# Altium schematic sheet RXTX4F.SchDoc
size B
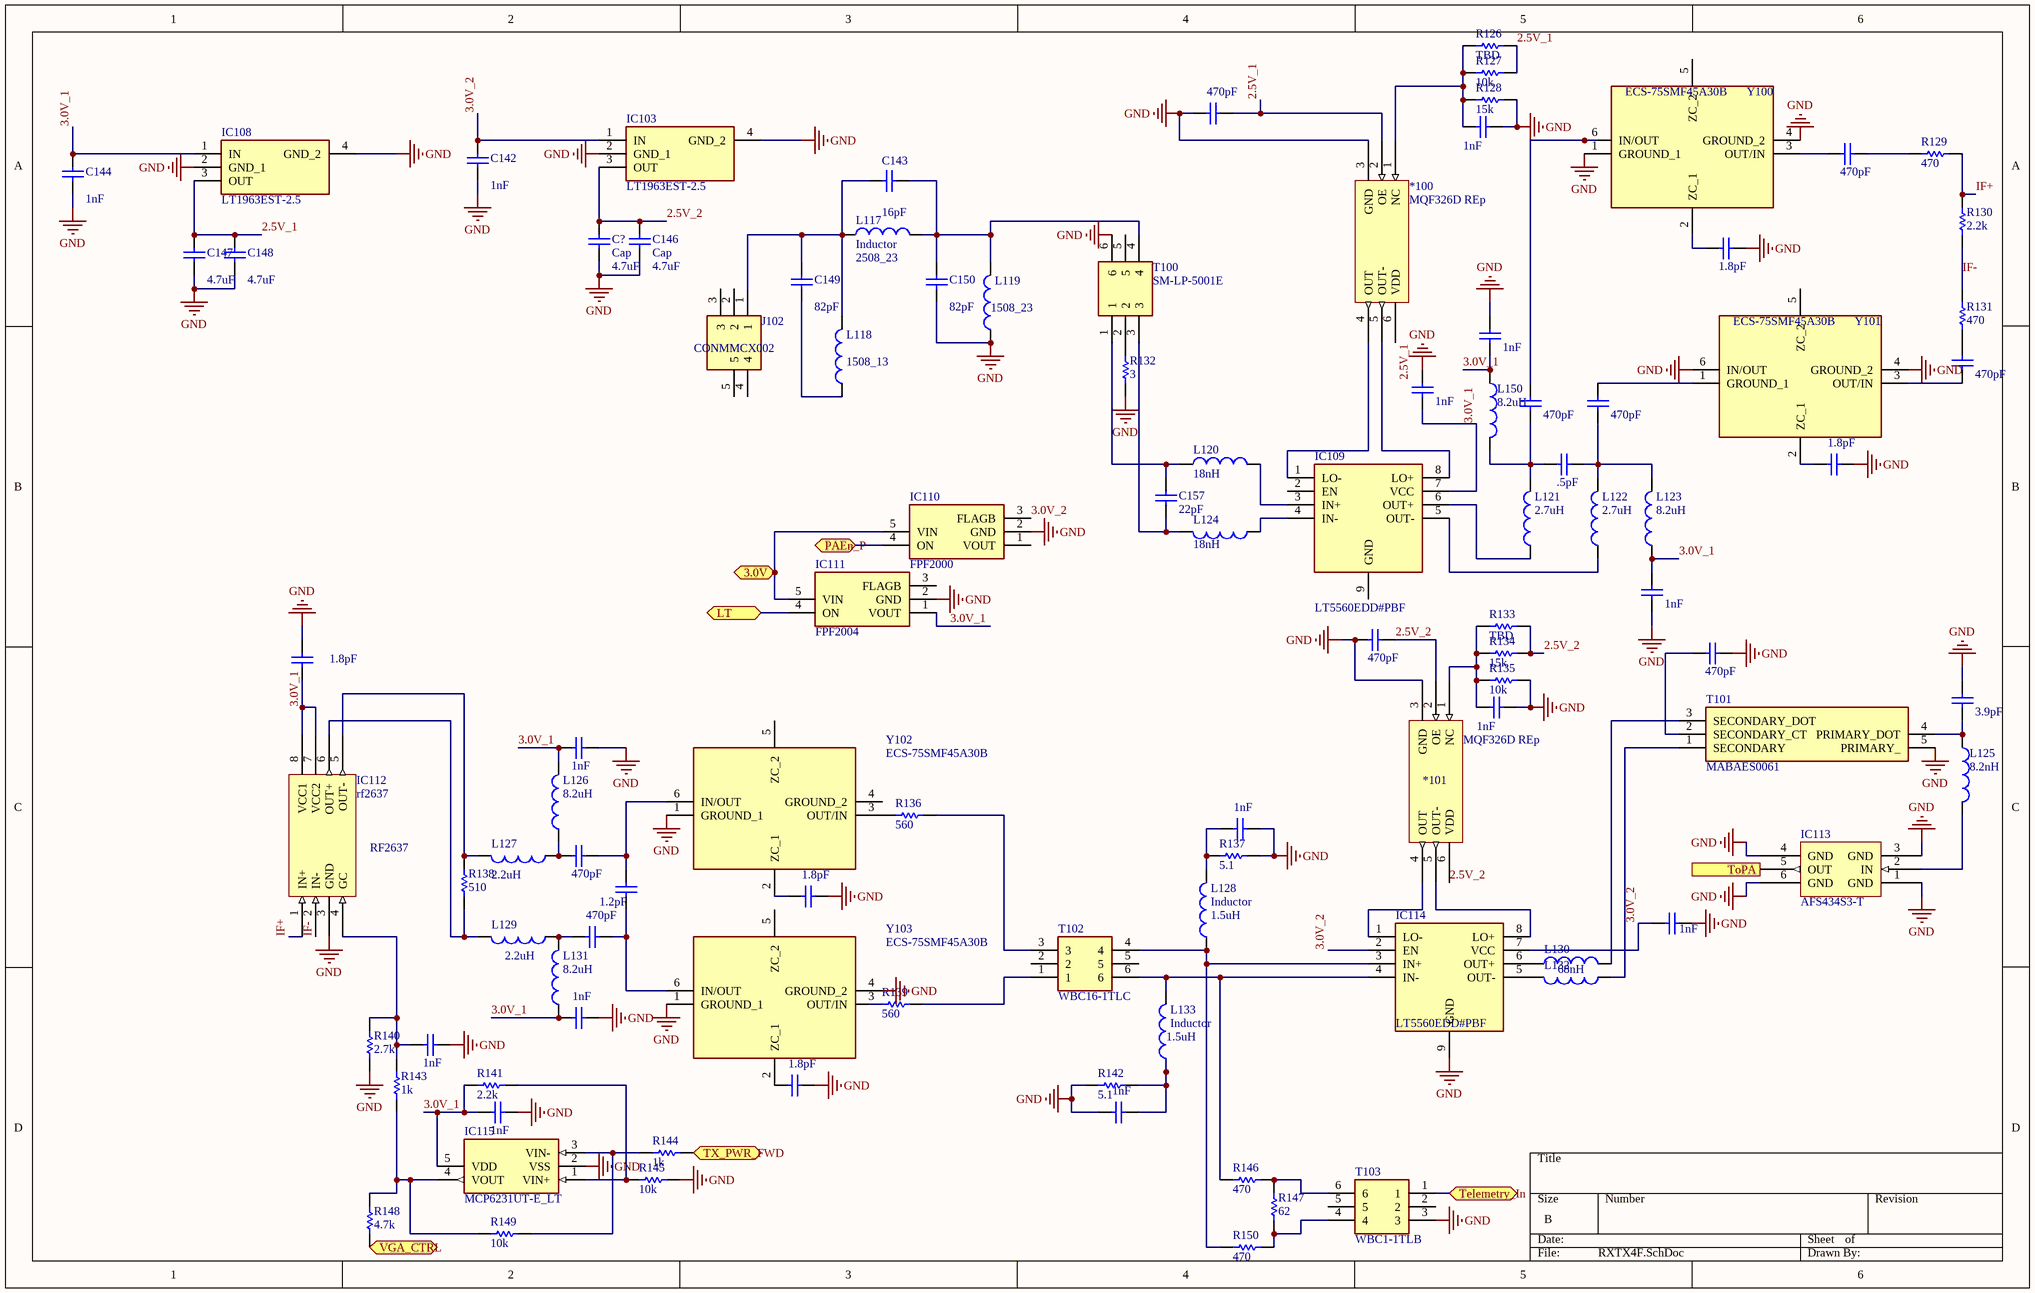
[diagram p0: RXTX4F.SchDoc]

## Parts
*100  MQF326D REp  [MQF326D]
*101  MQF326D REp  [MQF326D]
C139  value 470pF  [0603]  (hidden comment: Cap)
C140  value 1nF  [0603]  (hidden comment: Cap)
C141  value 470pF  [0603]  (hidden comment: Cap)
C142  value 1nF  [0603]  (hidden comment: Cap)
C143  value 16pF  [0603]  (hidden comment: Cap)
C144  value 1nF  [0603]  (hidden comment: Cap)
C145  value 1.8pF  [0603]  (hidden comment: Cap)
C146  Cap  value 4.7uF  [0603]
C147  value 4.7uF  [0603]  (hidden comment: Cap)
C148  value 4.7uF  [0603]  (hidden comment: Cap)
C149  value 82pF  [0603]  (hidden comment: Cap)
C150  value 82pF  [0603]  (hidden comment: Cap)
C151  value 470pF  [0603]  (hidden comment: Cap)
C152  value 1nF  [0603]  (hidden comment: Cap)
C153  value 470pF  [0603]  (hidden comment: Cap)
C154  value 470pF  [0603]  (hidden comment: Cap)
C155  value .5pF  [0603]  (hidden comment: Cap)
C156  value 1.8pF  [0603]  (hidden comment: Cap)
C157  value 22pF  [0603]  (hidden comment: Cap)
C158  value 1nF  [0603]  (hidden comment: Cap)
C159  value 470pF  [0603]  (hidden comment: Cap)
C160  value 470pF  [0603]  (hidden comment: Cap)
C161  value 1.8pF  [0603]  (hidden comment: Cap)
C162  value 1nF  [0603]  (hidden comment: Cap)
C163  value 3.9pF  [0603]  (hidden comment: Cap)
C164  value 1nF  [0603]  (hidden comment: Cap)
C165  value 1nF  [0603]  (hidden comment: Cap)
C166  value 470pF  [0603]  (hidden comment: Cap)
C167  value 1.8pF  [0603]  (hidden comment: Cap)
C168  value 1.2pF  [0603]  (hidden comment: Cap)
C169  value 1nF  [0603]  (hidden comment: Cap)
C170  value 470pF  [0603]  (hidden comment: Cap)
C171  value 1nF  [0603]  (hidden comment: Cap)
C172  value 1nF  [0603]  (hidden comment: Cap)
C173  value 1.8pF  [0603]  (hidden comment: Cap)
C174  value 1nF  [0603]  (hidden comment: Cap)
C175  value 1nF  [0603]  (hidden comment: Cap)
C199  value 1nF  [0603]  (hidden comment: Cap)
C?  Cap  value 4.7uF  [0603]
IC103  LT1963EST-2.5  [SOT230P700X180-4N]
IC108  LT1963EST-2.5  [SOT230P700X180-4N]
IC109  LT5560EDD#PBF  [SON50P300X300X80-9N-D]
IC110  FPF2000  [SOT65P210X110-5N]
IC111  FPF2004  [SOT65P210X110-5N]
IC112  rf2637  [RF2637]
IC113  AFS434S3-T  [AFS434S3]
IC114  LT5560EDD#PBF  [SON50P300X300X80-9N-D]
IC115  MCP6231UT-E_LT  [SOT65P210X110-5N]
J102  CONMMCX002  [CONMMCX002]
L117  Inductor  value 2508_23  [0603]
L118  value 1508_13  [0603]  (hidden comment: Inductor)
L119  value 1508_23  [0603]  (hidden comment: Inductor)
L120  value 18nH  [0603]  (hidden comment: Inductor)
L121  value 2.7uH  [0603]  (hidden comment: Inductor)
L122  value 2.7uH  [0603]  (hidden comment: Inductor)
L123  value 8.2uH  [0603]  (hidden comment: Inductor)
L124  value 18nH  [0603]  (hidden comment: Inductor)
L125  value 8.2nH  [0603]  (hidden comment: Inductor)
L126  value 8.2uH  [0603]  (hidden comment: Inductor)
L127  value 2.2uH  [0603]  (hidden comment: Inductor)
L128  Inductor  value 1.5uH  [0603]
L129  value 2.2uH  [0603]  (hidden comment: Inductor)
L130  value 68nH  [0603]  (hidden comment: Inductor)
L131  value 8.2uH  [0603]  (hidden comment: Inductor)
L132  Inductor  [0603]  (value not drawn)
L133  Inductor  value 1.5uH  [0603]
L150  value 8.2uH  [0603]  (hidden comment: Inductor)
R126  value TBD  [0603]  (hidden comment: Res1)
R127  value 10k  [0603]  (hidden comment: Res1)
R128  value 15k  [0603]  (hidden comment: Res1)
R129  value 470  [0603]  (hidden comment: Res1)
R130  value 2.2k  [0603]  (hidden comment: Res1)
R131  value 470  [0603]  (hidden comment: Res1)
R132  value 3  [0603]  (hidden comment: Res1)
R133  value TBD  [0603]  (hidden comment: Res1)
R134  value 15k  [0603]  (hidden comment: Res1)
R135  value 10k  [0603]  (hidden comment: Res1)
R136  value 560  [0603]  (hidden comment: Res1)
R137  value 5.1  [0603]  (hidden comment: Res1)
R138  value 510  [0603]  (hidden comment: Res1)
R139  value 560  [0603]  (hidden comment: Res1)
R140  value 2.7k  [0603]  (hidden comment: Res1)
R141  value 2.2k  [0603]  (hidden comment: Res1)
R142  value 5.1  [0603]  (hidden comment: Res1)
R143  value 1k  [0603]  (hidden comment: Res1)
R144  value 1k  [0603]  (hidden comment: Res1)
R145  value 10k  [0603]  (hidden comment: Res1)
R146  value 470  [0603]  (hidden comment: Res1)
R147  value 62  [0603]  (hidden comment: Res1)
R148  value 4.7k  [0603]  (hidden comment: Res1)
R149  value 10k  [0603]  (hidden comment: Res1)
R150  value 470  [0603]  (hidden comment: Res1)
T100  SM-LP-5001E  [SMLP5001E]
T101  MABAES0061  [MABAES0061]
T102  WBC16-1TLC  [WBC161TLC]
T103  WBC1-1TLB  [WBC11TLC]
Y100  ECS-75SMF45A30B  [ECS75SMF45A30B]
Y101  ECS-75SMF45A30B  [ECS75SMF45A30B]
Y102  ECS-75SMF45A30B  [ECS75SMF45A30B]
Y103  ECS-75SMF45A30B  [ECS75SMF45A30B]

## Ports
3.0V (bidir), LT (bidir), PAEn_P (bidir), Telemetry_In (bidir), ToPA (out), TX_PWR_FWD (bidir), VGA_CTRL (bidir)

## Nets
GND: *100.3(GND) *101.3(GND) C139.2 C140.1 C142.1 C144.1 C145.1 C146.1 C147.1 C148.1 C150.2 C152.1 C156.1 C158.1 C159.2 C160.1 C161.1 C162.1 C163.1 C164.1 C165.1 C167.1 C169.1 C171.1 C172.2 C173.1 C174.2 C175.2 C199.1 C?.1 IC103.2(GND_1) IC103.4(GND_2) IC108.2(GND_1) IC108.4(GND_2) IC110.2(GND) IC111.2(GND) IC112.3(GND) IC113.1(GND) IC113.3(GND) IC113.4(GND) IC113.6(GND) IC114.9(GND) IC115.2(VSS) L119.1 R128.1 R132.1 R135.1 R137.1 R140.2 R142.2 R145.2 T100.6 T101.5(PRIMARY_) T103.3 Y100.1(GROUND_1) Y100.4(GROUND_2) Y101.4(GROUND_2) Y101.6(IN/OUT) Y102.1(GROUND_1) Y103.1(GROUND_1) Y103.4(GROUND_2)
2.5V_1: *100.2(OE) *100.6(VDD) C139.1 C147.2 C148.2 IC108.3(OUT) R126.1 R127.1
2.5V_2: *101.2(OE) *101.6(VDD) C146.2 C160.2 C?.2 IC103.3(OUT) R133.1 R134.1
3.0V: IC110.5(VIN) IC111.5(VIN) ; port 3.0V
3.0V_1: C144.2 C152.2 C158.2 C161.2 C164.2 C171.2 C174.1 C199.2 IC108.1(IN) IC109.7(VCC) IC111.1(VOUT) IC112.7(VCC2) IC112.8(VCC1) IC115.5(VDD) L123.1 L126.2 L131.1 L150.1 R141.1
3.0V_2: C142.2 C169.2 IC103.1(IN) IC110.3(FLAGB) IC114.2(EN) IC114.7(VCC)
IF+: IC112.1(IN+) R129.1 R130.1
IF-: IC112.2(IN-) R130.2 R131.1
LT: IC111.4(ON) ; port LT
PAEn_P: IC110.4(ON) ; port PAEn_P
Telemetry_In: T103.1 ; port Telemetry_In
ToPA: IC113.5(OUT) ; port ToPA
TX_PWR_FWD: R144.2 ; port TX_PWR_FWD
VGA_CTRL: R148.2 ; port VGA_CTRL
Net*100_1: *100.1(NC) C140.2 R126.2 R127.2 R128.2
Net*100_4: *100.4(OUT) IC109.1(LO-)
Net*100_5: *100.5(OUT-) IC109.8(LO+)
Net*101_1: *101.1(NC) C162.2 R133.2 R134.2 R135.2
Net*101_4: *101.4(OUT) IC114.1(LO-)
Net*101_5: *101.5(OUT-) IC114.8(LO+)
NetC141_1: C141.1 R129.2
NetC141_2: C141.2 Y100.3(OUT/IN)
NetC143_1: C143.1 C150.1 L117.2 L119.2 T100.4
NetC143_2: C143.2 C149.1 J102.1 L117.1 L118.2
NetC145_2: C145.2 Y100.2(ZC_1)
NetC149_2: C149.2 L118.1
NetC151_1: C151.1 Y101.3(OUT/IN)
NetC151_2: C151.2 R131.2
NetC153_1: C153.1 C155.2 L121.2 L150.2
NetC153_2: C153.2 Y100.6(IN/OUT)
NetC154_1: C154.1 C155.1 L122.2 L123.2
NetC154_2: C154.2 Y101.1(GROUND_1)
NetC156_2: C156.2 Y101.2(ZC_1)
NetC157_1: C157.1 L120.1 T100.1
NetC157_2: C157.2 L124.2 T100.3
NetC159_1: C159.1 T101.2(SECONDARY_CT)
NetC163_2: C163.2 L125.1 T101.4(PRIMARY_DOT)
NetC165_2: C165.2 L128.2 R137.2
NetC166_1: C166.1 C168.1 Y102.6(IN/OUT)
NetC166_2: C166.2 L126.1 L127.1
NetC167_2: C167.2 Y102.2(ZC_1)
NetC168_2: C168.2 C170.1 Y103.6(IN/OUT)
NetC170_2: C170.2 L129.1 L131.2
NetC172_1: C172.1 IC112.4(GC) R140.1 R143.1
NetC173_2: C173.2 Y103.2(ZC_1)
NetC175_1: C175.1 L133.1 R142.1
NetIC109_3: IC109.3(IN+) L120.2
NetIC109_4: IC109.4(IN-) L124.1
NetIC109_5: IC109.5(OUT-) L122.1
NetIC109_6: IC109.6(OUT+) L121.1
NetIC112_5: IC112.5(OUT-) L127.2 R138.1
NetIC112_6: IC112.6(OUT+) L129.2 R138.2
NetIC113_2: IC113.2(IN) L125.2
NetIC114_3: IC114.3(IN+) L128.1 R150.2 T102.4
NetIC114_4: IC114.4(IN-) L133.2 R146.2 T102.6
NetIC114_5: IC114.5(OUT-) L132.2
NetIC114_6: IC114.6(OUT+) L130.1
NetIC115_1: IC115.1(VIN+) R141.2 R145.1
NetIC115_3: IC115.3(VIN-) R144.1 R149.2
NetIC115_4: IC115.4(VOUT) R143.2 R148.1 R149.1
NetL130_2: L130.2 T101.3(SECONDARY_DOT)
NetL132_1: L132.1 T101.1(SECONDARY)
NetR132_2: R132.2 T100.2
NetR136_1: R136.1 T102.3
NetR136_2: R136.2 Y102.3(OUT/IN)
NetR139_1: R139.1 T102.1
NetR139_2: R139.2 Y103.3(OUT/IN)
NetR146_1: R146.1 R147.1 T103.6
NetR147_2: R147.2 R150.1 T103.4

Not connected (* = marked no-connect by the designer): IC109 2(EN) 9(GND); IC110 1(VOUT); IC111 3(FLAGB); J102 2 3 4 5; T100 5; T102 2 5; T103 2 5; Y100 5(ZC_2); Y101 5(ZC_2); Y102 4(GROUND_2) 5(ZC_2); Y103 5(ZC_2)

## Notes on the sheet
- (near IC112) RF2637

## Library data of the parts
*100 *101 IC112 IC113 = Component_1
C139-C175 C199 C? = Cap: Capacitor; Published: 8-Jun-2000; LatestRevisionDate: 17-Jul-2002; LatestRevisionNote: Re-released for DXP Platform.; PackageReference: RAD-0.3; Publisher: Altium Limited; PackageDescription: Radial Cap, Thru-Hole; 2 Leads; 0.3 in Pin Spacing
IC103 IC108 = LT1963EST-2.5: Integrated Circuit; Manufacturer_Name: Linear Technology; Datasheet Link: https://www.mouser.com/datasheet/2/609/1963fc-1270290.pdf; Height: 1.8mm; Manufacturer_Part_Number: LT1963EST-2.5; Mouser Part Number: 584-LT1963EST-2.5; Mouser Price/Stock: https://www.mouser.com/Search/Refine.aspx?Keyword=584-LT1963EST-2.5
IC109 IC114 = LT5560EDD#PBF: Integrated Circuit; Manufacturer_Name: Linear Technology; Datasheet Link: https://www.analog.com/media/en/technical-documentation/data-sheets/5560f.pdf; Height: 0.8mm; Manufacturer_Part_Number: LT5560EDD#PBF; Mouser Part Number: 584-LT5560EDD#PBF; Mouser Price/Stock: https://www.mouser.com/Search/Refine.aspx?Keyword=584-LT5560EDD%23PBF; RS Part Number: 7869705; RS Price/Stock: https://uk.rs-online.com/web/p/products/7869705
IC110 = FPF2000: Integrated Circuit; Manufacturer_Name: ON Semiconductor; Datasheet Link: https://www.onsemi.com/pub/Collateral/FPF2001-D.pdf; Height: 1.1mm; Manufacturer_Part_Number: FPF2000; Mouser Part Number: 512-FPF2000; Mouser Price/Stock: https://www.mouser.com/Search/Refine.aspx?Keyword=512-FPF2000; RS Part Number: 6709942P; RS Price/Stock: http://uk.rs-online.com/web/p/products/6709942P
IC111 = FPF2004: Integrated Circuit; Manufacturer_Name: ON Semiconductor; Datasheet Link: https://www.onsemi.com/pub/Collateral/FPF2001-D.pdf; Height: 1.1mm; Manufacturer_Part_Number: FPF2004; Mouser Part Number: 512-FPF2004; Mouser Price/Stock: https://www.mouser.com/Search/Refine.aspx?Keyword=512-FPF2004; RS Part Number: 8088916P; RS Price/Stock: http://uk.rs-online.com/web/p/products/8088916P
IC115 = MCP6231UT-E_LT: Integrated Circuit; Manufacturer_Name: Microchip; Manufacturer_Part_Number: MCP6231UT-E/LT; Allied_Number: 70414866; Datasheet Link: http://ww1.microchip.com/downloads/en/DeviceDoc/21881e.pdf; Height: 1.1mm; Mouser Part Number: 579-MCP6231UT-E/LT; Mouser Price/Stock: https://www.mouser.com/Search/Refine.aspx?Keyword=579-MCP6231UT-E%2FLT; RS Part Number: 7240643P; RS Price/Stock: http://uk.rs-online.com/web/p/products/7240643P; Allied Price/Stock: http://www.alliedelec.com/microchip-technology-inc-mcp6231ut-e-lt/70414866/
J102 = CONMMCX002: Connector; Manufacturer_Name: Linx Technologies; Datasheet Link: https://linxtechnologies.com/wp/wp-content/uploads/conmmcx002.pdf; Height: 3.45mm; Manufacturer_Part_Number: CONMMCX002; Mouser Part Number: 712-CONMMCX002; Mouser Price/Stock: https://www.mouser.com/Search/Refine.aspx?Keyword=712-CONMMCX002
L117-L133 L150 = Inductor: Code_IEC: 1005; Published: 8-Jun-2000; LatestRevisionDate: 29-May-2009; LatestRevisionNote: IPC-7351 Footprint Added.; PackageReference: 0402-A; Publisher: Altium Limited; PackageDescription: Chip Inductor; Code_JEITA: 0402
R126-R150 = Res1: Resistor; Published: 8-Jun-2000; LatestRevisionDate: 17-Jul-2002; LatestRevisionNote: Re-released for DXP Platform.; PackageReference: AXIAL-0.3; Publisher: Altium Limited; PackageDescription: Axial Device, Thru-Hole; 2 Leads; 0.3 in Pin Spacing
T100 = SM-LP-5001E: Transformer; Manufacturer_Name: Bourns; Allied_Number: 70155232; Datasheet Link: https://www.bourns.com/pdfs/SMLP5001.pdf; Height: 7mm; Manufacturer_Part_Number: SM-LP-5001E; Mouser Part Number: 652-SM-LP-5001E; Mouser Price/Stock: https://www.mouser.com/Search/Refine.aspx?Keyword=652-SM-LP-5001E; RS Part Number: 1728670; RS Price/Stock: https://uk.rs-online.com/web/p/products/1728670; Allied Price/Stock: https://www.alliedelec.com/bourns-sm-lp-5001e/70155232/
T101 = MABAES0061: Transformer; Manufacturer_Name: MACOM; Datasheet Link: https://componentsearchengine.com/Datasheets/1/MABAES0061.pdf; Height: 0.64mm; Manufacturer_Part_Number: MABAES0061; Mouser Part Number: 937-MABAES0061; Mouser Price/Stock: https://www.mouser.com/Search/Refine.aspx?Keyword=937-MABAES0061
T102 = WBC16-1TLC: Transformer; Manufacturer_Name: COILCRAFT; Datasheet Link: https://www.coilcraft.com/pdfs/wbc.pdf; Height: 3mm; Manufacturer_Part_Number: WBC16-1TLC; Mouser Part Number: 994-WBC16-1TLC; Mouser Price/Stock: https://www.mouser.com/Search/Refine.aspx?Keyword=994-WBC16-1TLC
T103 = WBC1-1TLB: Transformer; Manufacturer_Name: COILCRAFT; Datasheet Link: http://www.mouser.com/datasheet/2/597/wbc-463492.pdf; Height: 3mm; Manufacturer_Part_Number: WBC1-1TLB; Mouser Part Number: 994-WBC1-1TLB; Mouser Price/Stock: https://www.mouser.co.uk/ProductDetail/Coilcraft/WBC1-1TLB?qs=ZYnrCdKdyefPGG%252BYZVKz5Q%3D%3D
Y100-Y103 = ECS-75SMF45A30B: Crystal or Oscillator; Manufacturer_Name: ECS; Datasheet Link: https://www.mouser.com/datasheet/2/122/ECS_75SMF-10007.pdf; Height: 0.95mm; Manufacturer_Part_Number: ECS-75SMF45A30B; Mouser Part Number: 520-ECS-75SMF45A30B; Mouser Price/Stock: https://www.mouser.com/Search/Refine.aspx?Keyword=520-ECS-75SMF45A30B